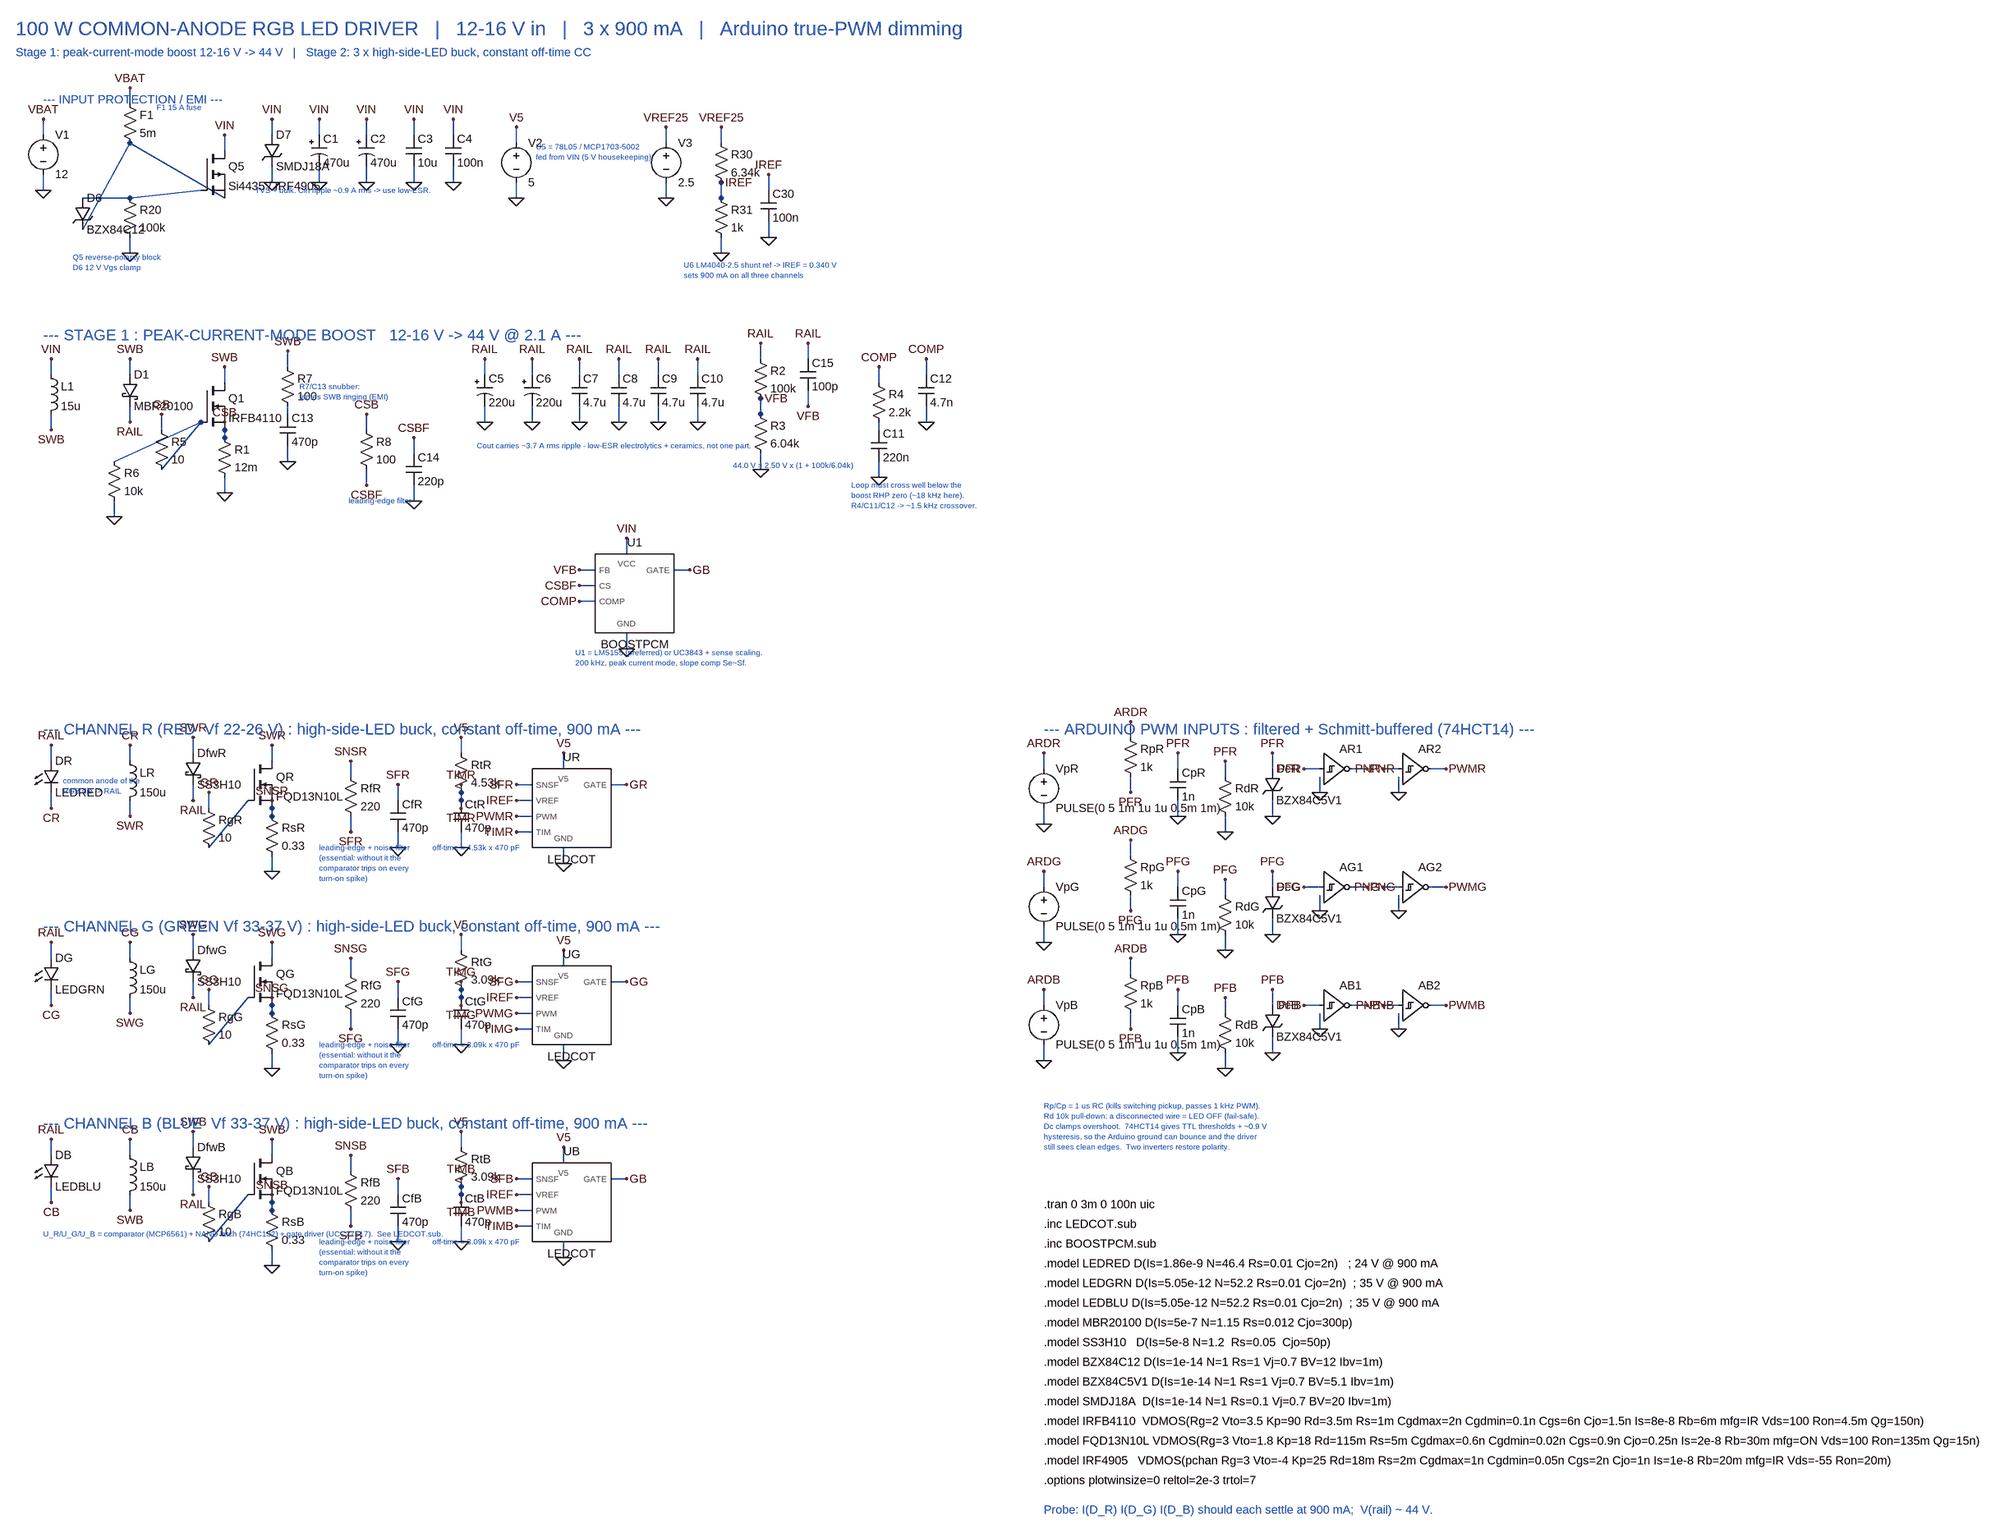
[diagram p0: schematic RGB100W_Driver.asc]
RGB100W_Driver.asc, the LTspice schematic file:
Version 4
SHEET 1 4800 3200
TEXT 40 40 Left 4 100 W COMMON-ANODE RGB LED DRIVER   |   12-16 V in   |   3 x 900 mA   |   Arduino true-PWM dimming
TEXT 40 88 Left 2 Stage 1: peak-current-mode boost 12-16 V -> 44 V   |   Stage 2: 3 x high-side-LED buck, constant off-time CC
TEXT 96 184 Left 2 --- INPUT PROTECTION / EMI ---
SYMBOL voltage 96 240 R0
SYMATTR InstName V1
SYMATTR Value 12
SYMATTR SpiceLine Rser=0.02
WIRE 96 336 96 368
FLAG 96 368 0
WIRE 96 256 96 224
FLAG 96 224 VBAT
SYMBOL res 256 176 R0
SYMATTR InstName F1
SYMATTR Value 5m
WIRE 272 192 272 160
FLAG 272 160 VBAT
TEXT 326 200 Left 1 F1 15 A fuse
SYMBOL pmos 416 288 R0
SYMATTR InstName Q5
SYMATTR Value Si4435 / IRF4905
WIRE 272 272 464 384
WIRE 464 288 464 256
FLAG 464 256 VIN
SYMBOL res 256 368 R0
SYMATTR InstName R20
SYMATTR Value 100k
WIRE 272 384 416 368
WIRE 272 464 272 496
FLAG 272 496 0
SYMBOL zener 160 384 R0
SYMATTR InstName D6
SYMATTR Value BZX84C12
WIRE 176 384 272 384
WIRE 176 448 272 272
TEXT 156 504 Left 1 Q5 reverse-polarity block\nD6 12 V Vgs clamp
SYMBOL zener 544 256 R0
SYMATTR InstName D7
SYMATTR Value SMDJ18A
WIRE 560 256 560 224
FLAG 560 224 VIN
WIRE 560 320 560 352
FLAG 560 352 0
SYMBOL polcap 640 256 R0
SYMATTR InstName C1
SYMATTR Value 470u
SYMATTR SpiceLine V=25 Rser=0.03
WIRE 656 256 656 224
FLAG 656 224 VIN
WIRE 656 320 656 352
FLAG 656 352 0
SYMBOL polcap 736 256 R0
SYMATTR InstName C2
SYMATTR Value 470u
SYMATTR SpiceLine V=25 Rser=0.03
WIRE 752 256 752 224
FLAG 752 224 VIN
WIRE 752 320 752 352
FLAG 752 352 0
SYMBOL cap 832 256 R0
SYMATTR InstName C3
SYMATTR Value 10u
SYMATTR SpiceLine V=25
WIRE 848 256 848 224
FLAG 848 224 VIN
WIRE 848 320 848 352
FLAG 848 352 0
SYMBOL cap 912 256 R0
SYMATTR InstName C4
SYMATTR Value 100n
WIRE 928 256 928 224
FLAG 928 224 VIN
WIRE 928 320 928 352
FLAG 928 352 0
TEXT 526 368 Left 1 TVS + bulk. Cin ripple ~0.9 A rms -> use low-ESR.
SYMBOL voltage 1056 256 R0
SYMATTR InstName V2
SYMATTR Value 5
WIRE 1056 272 1056 240
FLAG 1056 240 V5
WIRE 1056 352 1056 384
FLAG 1056 384 0
TEXT 1096 280 Left 1 U5 = 78L05 / MCP1703-5002\nfed from VIN (5 V housekeeping)
SYMBOL voltage 1360 256 R0
SYMATTR InstName V3
SYMATTR Value 2.5
WIRE 1360 272 1360 240
FLAG 1360 240 VREF25
WIRE 1360 352 1360 384
FLAG 1360 384 0
SYMBOL res 1456 256 R0
SYMATTR InstName R30
SYMATTR Value 6.34k
WIRE 1472 272 1472 240
FLAG 1472 240 VREF25
SYMBOL res 1456 368 R0
SYMATTR InstName R31
SYMATTR Value 1k
WIRE 1472 352 1472 384
WIRE 1472 464 1472 496
FLAG 1472 496 0
WIRE 1472 384 1472 352
FLAG 1472 352 IREF
SYMBOL cap 1552 368 R0
SYMATTR InstName C30
SYMATTR Value 100n
WIRE 1568 368 1568 336
FLAG 1568 336 IREF
WIRE 1568 432 1568 464
FLAG 1568 464 0
TEXT 1396 520 Left 1 U6 LM4040-2.5 shunt ref -> IREF = 0.340 V\nsets 900 mA on all three channels
TEXT 96 736 Left 3 --- STAGE 1 : PEAK-CURRENT-MODE BOOST   12-16 V -> 44 V @ 2.1 A ---
SYMBOL ind 96 800 R0
SYMATTR InstName L1
SYMATTR Value 15u
SYMATTR SpiceLine Rser=0.008 Ipk=14
WIRE 112 816 112 784
FLAG 112 784 VIN
WIRE 112 896 112 928
FLAG 112 928 SWB
SYMBOL schottky 256 816 R0
SYMATTR InstName D1
SYMATTR Value MBR20100
WIRE 272 816 272 784
FLAG 272 784 SWB
WIRE 272 880 272 912
FLAG 272 912 RAIL
SYMBOL nmos 416 832 R0
SYMATTR InstName Q1
SYMATTR Value IRFB4110
WIRE 464 832 464 800
FLAG 464 800 SWB
SYMBOL res 448 928 R0
SYMATTR InstName R1
SYMATTR Value 12m
WIRE 464 928 464 944
WIRE 464 1024 464 1056
FLAG 464 1056 0
WIRE 464 944 464 912
FLAG 464 912 CSB
SYMBOL res 320 912 R0
SYMATTR InstName R5
SYMATTR Value 10
WIRE 336 1008 416 912
WIRE 336 928 336 896
FLAG 336 896 GB
SYMBOL res 224 976 R0
SYMATTR InstName R6
SYMATTR Value 10k
WIRE 240 992 416 912
WIRE 240 1072 240 1104
FLAG 240 1104 0
SYMBOL res 576 784 R0
SYMATTR InstName R7
SYMATTR Value 100
WIRE 592 800 592 768
FLAG 592 768 SWB
SYMBOL cap 576 896 R0
SYMATTR InstName C13
SYMATTR Value 470p
WIRE 592 880 592 896
WIRE 592 960 592 992
FLAG 592 992 0
TEXT 616 840 Left 1 R7/C13 snubber:\ntames SWB ringing (EMI)
SYMBOL res 736 912 R0
SYMATTR InstName R8
SYMATTR Value 100
WIRE 752 928 752 896
FLAG 752 896 CSB
WIRE 752 1008 752 1040
FLAG 752 1040 CSBF
SYMBOL cap 832 976 R0
SYMATTR InstName C14
SYMATTR Value 220p
WIRE 848 976 848 944
FLAG 848 944 CSBF
WIRE 848 1040 848 1072
FLAG 848 1072 0
TEXT 716 1072 Left 1 leading-edge filter
SYMBOL polcap 976 816 R0
SYMATTR InstName C5
SYMATTR Value 220u
SYMATTR SpiceLine V=63 Rser=0.045
WIRE 992 816 992 784
FLAG 992 784 RAIL
WIRE 992 880 992 912
FLAG 992 912 0
SYMBOL polcap 1072 816 R0
SYMATTR InstName C6
SYMATTR Value 220u
SYMATTR SpiceLine V=63 Rser=0.045
WIRE 1088 816 1088 784
FLAG 1088 784 RAIL
WIRE 1088 880 1088 912
FLAG 1088 912 0
SYMBOL cap 1168 816 R0
SYMATTR InstName C7
SYMATTR Value 4.7u
SYMATTR SpiceLine V=100
WIRE 1184 816 1184 784
FLAG 1184 784 RAIL
WIRE 1184 880 1184 912
FLAG 1184 912 0
SYMBOL cap 1248 816 R0
SYMATTR InstName C8
SYMATTR Value 4.7u
SYMATTR SpiceLine V=100
WIRE 1264 816 1264 784
FLAG 1264 784 RAIL
WIRE 1264 880 1264 912
FLAG 1264 912 0
SYMBOL cap 1328 816 R0
SYMATTR InstName C9
SYMATTR Value 4.7u
SYMATTR SpiceLine V=100
WIRE 1344 816 1344 784
FLAG 1344 784 RAIL
WIRE 1344 880 1344 912
FLAG 1344 912 0
SYMBOL cap 1408 816 R0
SYMATTR InstName C10
SYMATTR Value 4.7u
SYMATTR SpiceLine V=100
WIRE 1424 816 1424 784
FLAG 1424 784 RAIL
WIRE 1424 880 1424 912
FLAG 1424 912 0
TEXT 976 960 Left 1 Cout carries ~3.7 A rms ripple - low-ESR electrolytics + ceramics, not one part.
SYMBOL res 1536 768 R0
SYMATTR InstName R2
SYMATTR Value 100k
WIRE 1552 784 1552 752
FLAG 1552 752 RAIL
SYMBOL res 1536 880 R0
SYMATTR InstName R3
SYMATTR Value 6.04k
WIRE 1552 864 1552 896
WIRE 1552 976 1552 1008
FLAG 1552 1008 0
WIRE 1552 896 1552 864
FLAG 1552 864 VFB
SYMBOL cap 1632 784 R0
SYMATTR InstName C15
SYMATTR Value 100p
WIRE 1648 784 1648 752
FLAG 1648 752 RAIL
WIRE 1648 848 1648 880
FLAG 1648 880 VFB
TEXT 1496 1000 Left 1 44.0 V = 2.50 V x (1 + 100k/6.04k)
SYMBOL res 1776 816 R0
SYMATTR InstName R4
SYMATTR Value 2.2k
WIRE 1792 832 1792 800
FLAG 1792 800 COMP
SYMBOL cap 1776 928 R0
SYMATTR InstName C11
SYMATTR Value 220n
WIRE 1792 912 1792 928
WIRE 1792 992 1792 1024
FLAG 1792 1024 0
SYMBOL cap 1872 816 R0
SYMATTR InstName C12
SYMATTR Value 4.7n
WIRE 1888 816 1888 784
FLAG 1888 784 COMP
WIRE 1888 880 1888 912
FLAG 1888 912 0
TEXT 1736 1040 Left 1 Loop must cross well below the\nboost RHP zero (~18 kHz here).\nR4/C11/C12 -> ~1.5 kHz crossover.
SYMBOL BOOSTPCM 1216 1180 R0
SYMATTR InstName U1
SYMATTR Value BOOSTPCM
SYMATTR SpiceLine Fsw=200k Ksl=0.13 Vthmax=0.42
WIRE 1216 1212 1184 1212
FLAG 1184 1212 VFB
WIRE 1216 1244 1184 1244
FLAG 1184 1244 CSBF
WIRE 1216 1276 1184 1276
FLAG 1184 1276 COMP
WIRE 1376 1212 1408 1212
FLAG 1408 1212 GB
WIRE 1280 1180 1280 1148
FLAG 1280 1148 VIN
WIRE 1280 1340 1280 1372
FLAG 1280 1372 0
TEXT 1176 1380 Left 1 U1 = LM5155 (preferred) or UC3843 + sense scaling.\n200 kHz, peak current mode, slope comp Se~Sf.
TEXT 96 1536 Left 3 --- CHANNEL R (RED  Vf 22-26 V) : high-side-LED buck, constant off-time, 900 mA ---
SYMBOL LED 96 1600 R0
SYMATTR InstName DR
SYMATTR Value LEDRED
WIRE 112 1600 112 1568
FLAG 112 1568 RAIL
WIRE 112 1664 112 1696
FLAG 112 1696 CR
TEXT 136 1640 Left 1 common anode of the\nRGB die -> RAIL
SYMBOL ind 256 1584 R0
SYMATTR InstName LR
SYMATTR Value 150u
SYMATTR SpiceLine Rser=0.15 Ipk=2
WIRE 272 1600 272 1568
FLAG 272 1568 CR
WIRE 272 1680 272 1712
FLAG 272 1712 SWR
SYMBOL schottky 384 1584 R0
SYMATTR InstName DfwR
SYMATTR Value SS3H10
WIRE 400 1584 400 1552
FLAG 400 1552 SWR
WIRE 400 1648 400 1680
FLAG 400 1680 RAIL
SYMBOL nmos 512 1600 R0
SYMATTR InstName QR
SYMATTR Value FQD13N10L
WIRE 560 1600 560 1568
FLAG 560 1568 SWR
SYMBOL res 544 1696 R0
SYMATTR InstName RsR
SYMATTR Value 0.33
WIRE 560 1696 560 1712
WIRE 560 1792 560 1824
FLAG 560 1824 0
WIRE 560 1712 560 1680
FLAG 560 1680 SNSR
SYMBOL res 416 1680 R0
SYMATTR InstName RgR
SYMATTR Value 10
WIRE 432 1776 512 1680
WIRE 432 1696 432 1664
FLAG 432 1664 GR
SYMBOL res 704 1616 R0
SYMATTR InstName RfR
SYMATTR Value 220
WIRE 720 1632 720 1600
FLAG 720 1600 SNSR
WIRE 720 1712 720 1744
FLAG 720 1744 SFR
SYMBOL cap 800 1680 R0
SYMATTR InstName CfR
SYMATTR Value 470p
WIRE 816 1680 816 1648
FLAG 816 1648 SFR
WIRE 816 1744 816 1776
FLAG 816 1776 0
TEXT 656 1776 Left 1 leading-edge + noise filter\n(essential: without it the\ncomparator trips on every\nturn-on spike)
SYMBOL res 928 1568 R0
SYMATTR InstName RtR
SYMATTR Value 4.53k
WIRE 944 1584 944 1552
FLAG 944 1552 V5
WIRE 944 1664 944 1696
FLAG 944 1696 TIMR
SYMBOL cap 928 1680 R0
SYMATTR InstName CtR
SYMATTR Value 470p
WIRE 944 1680 944 1648
FLAG 944 1648 TIMR
WIRE 944 1744 944 1776
FLAG 944 1776 0
TEXT 886 1776 Left 1 off-time = 4.53k x 470 pF
SYMBOL LEDCOT 1088 1616 R0
SYMATTR InstName UR
SYMATTR Value LEDCOT
WIRE 1088 1648 1056 1648
FLAG 1056 1648 SFR
WIRE 1088 1680 1056 1680
FLAG 1056 1680 IREF
WIRE 1088 1712 1056 1712
FLAG 1056 1712 PWMR
WIRE 1088 1744 1056 1744
FLAG 1056 1744 TIMR
WIRE 1248 1648 1280 1648
FLAG 1280 1648 GR
WIRE 1152 1616 1152 1584
FLAG 1152 1584 V5
WIRE 1152 1776 1152 1808
FLAG 1152 1808 0
TEXT 96 1936 Left 3 --- CHANNEL G (GREEN Vf 33-37 V) : high-side-LED buck, constant off-time, 900 mA ---
SYMBOL LED 96 2000 R0
SYMATTR InstName DG
SYMATTR Value LEDGRN
WIRE 112 2000 112 1968
FLAG 112 1968 RAIL
WIRE 112 2064 112 2096
FLAG 112 2096 CG
TEXT 136 2040 Left 1 
SYMBOL ind 256 1984 R0
SYMATTR InstName LG
SYMATTR Value 150u
SYMATTR SpiceLine Rser=0.15 Ipk=2
WIRE 272 2000 272 1968
FLAG 272 1968 CG
WIRE 272 2080 272 2112
FLAG 272 2112 SWG
SYMBOL schottky 384 1984 R0
SYMATTR InstName DfwG
SYMATTR Value SS3H10
WIRE 400 1984 400 1952
FLAG 400 1952 SWG
WIRE 400 2048 400 2080
FLAG 400 2080 RAIL
SYMBOL nmos 512 2000 R0
SYMATTR InstName QG
SYMATTR Value FQD13N10L
WIRE 560 2000 560 1968
FLAG 560 1968 SWG
SYMBOL res 544 2096 R0
SYMATTR InstName RsG
SYMATTR Value 0.33
WIRE 560 2096 560 2112
WIRE 560 2192 560 2224
FLAG 560 2224 0
WIRE 560 2112 560 2080
FLAG 560 2080 SNSG
SYMBOL res 416 2080 R0
SYMATTR InstName RgG
SYMATTR Value 10
WIRE 432 2176 512 2080
WIRE 432 2096 432 2064
FLAG 432 2064 GG
SYMBOL res 704 2016 R0
SYMATTR InstName RfG
SYMATTR Value 220
WIRE 720 2032 720 2000
FLAG 720 2000 SNSG
WIRE 720 2112 720 2144
FLAG 720 2144 SFG
SYMBOL cap 800 2080 R0
SYMATTR InstName CfG
SYMATTR Value 470p
WIRE 816 2080 816 2048
FLAG 816 2048 SFG
WIRE 816 2144 816 2176
FLAG 816 2176 0
TEXT 656 2176 Left 1 leading-edge + noise filter\n(essential: without it the\ncomparator trips on every\nturn-on spike)
SYMBOL res 928 1968 R0
SYMATTR InstName RtG
SYMATTR Value 3.09k
WIRE 944 1984 944 1952
FLAG 944 1952 V5
WIRE 944 2064 944 2096
FLAG 944 2096 TIMG
SYMBOL cap 928 2080 R0
SYMATTR InstName CtG
SYMATTR Value 470p
WIRE 944 2080 944 2048
FLAG 944 2048 TIMG
WIRE 944 2144 944 2176
FLAG 944 2176 0
TEXT 886 2176 Left 1 off-time = 3.09k x 470 pF
SYMBOL LEDCOT 1088 2016 R0
SYMATTR InstName UG
SYMATTR Value LEDCOT
WIRE 1088 2048 1056 2048
FLAG 1056 2048 SFG
WIRE 1088 2080 1056 2080
FLAG 1056 2080 IREF
WIRE 1088 2112 1056 2112
FLAG 1056 2112 PWMG
WIRE 1088 2144 1056 2144
FLAG 1056 2144 TIMG
WIRE 1248 2048 1280 2048
FLAG 1280 2048 GG
WIRE 1152 2016 1152 1984
FLAG 1152 1984 V5
WIRE 1152 2176 1152 2208
FLAG 1152 2208 0
TEXT 96 2336 Left 3 --- CHANNEL B (BLUE  Vf 33-37 V) : high-side-LED buck, constant off-time, 900 mA ---
SYMBOL LED 96 2400 R0
SYMATTR InstName DB
SYMATTR Value LEDBLU
WIRE 112 2400 112 2368
FLAG 112 2368 RAIL
WIRE 112 2464 112 2496
FLAG 112 2496 CB
TEXT 136 2440 Left 1 
SYMBOL ind 256 2384 R0
SYMATTR InstName LB
SYMATTR Value 150u
SYMATTR SpiceLine Rser=0.15 Ipk=2
WIRE 272 2400 272 2368
FLAG 272 2368 CB
WIRE 272 2480 272 2512
FLAG 272 2512 SWB
SYMBOL schottky 384 2384 R0
SYMATTR InstName DfwB
SYMATTR Value SS3H10
WIRE 400 2384 400 2352
FLAG 400 2352 SWB
WIRE 400 2448 400 2480
FLAG 400 2480 RAIL
SYMBOL nmos 512 2400 R0
SYMATTR InstName QB
SYMATTR Value FQD13N10L
WIRE 560 2400 560 2368
FLAG 560 2368 SWB
SYMBOL res 544 2496 R0
SYMATTR InstName RsB
SYMATTR Value 0.33
WIRE 560 2496 560 2512
WIRE 560 2592 560 2624
FLAG 560 2624 0
WIRE 560 2512 560 2480
FLAG 560 2480 SNSB
SYMBOL res 416 2480 R0
SYMATTR InstName RgB
SYMATTR Value 10
WIRE 432 2576 512 2480
WIRE 432 2496 432 2464
FLAG 432 2464 GB
SYMBOL res 704 2416 R0
SYMATTR InstName RfB
SYMATTR Value 220
WIRE 720 2432 720 2400
FLAG 720 2400 SNSB
WIRE 720 2512 720 2544
FLAG 720 2544 SFB
SYMBOL cap 800 2480 R0
SYMATTR InstName CfB
SYMATTR Value 470p
WIRE 816 2480 816 2448
FLAG 816 2448 SFB
WIRE 816 2544 816 2576
FLAG 816 2576 0
TEXT 656 2576 Left 1 leading-edge + noise filter\n(essential: without it the\ncomparator trips on every\nturn-on spike)
SYMBOL res 928 2368 R0
SYMATTR InstName RtB
SYMATTR Value 3.09k
WIRE 944 2384 944 2352
FLAG 944 2352 V5
WIRE 944 2464 944 2496
FLAG 944 2496 TIMB
SYMBOL cap 928 2480 R0
SYMATTR InstName CtB
SYMATTR Value 470p
WIRE 944 2480 944 2448
FLAG 944 2448 TIMB
WIRE 944 2544 944 2576
FLAG 944 2576 0
TEXT 886 2576 Left 1 off-time = 3.09k x 470 pF
SYMBOL LEDCOT 1088 2416 R0
SYMATTR InstName UB
SYMATTR Value LEDCOT
WIRE 1088 2448 1056 2448
FLAG 1056 2448 SFB
WIRE 1088 2480 1056 2480
FLAG 1056 2480 IREF
WIRE 1088 2512 1056 2512
FLAG 1056 2512 PWMB
WIRE 1088 2544 1056 2544
FLAG 1056 2544 TIMB
WIRE 1248 2448 1280 2448
FLAG 1280 2448 GB
WIRE 1152 2416 1152 2384
FLAG 1152 2384 V5
WIRE 1152 2576 1152 2608
FLAG 1152 2608 0
TEXT 96 2560 Left 1 U_R/U_G/U_B = comparator (MCP6561) + NAND latch (74HC132) + gate driver (UCC27517).  See LEDCOT.sub.
TEXT 2400 1536 Left 3 --- ARDUINO PWM INPUTS : filtered + Schmitt-buffered (74HCT14) ---
SYMBOL voltage 2400 1600 R0
SYMATTR InstName VpR
SYMATTR Value PULSE(0 5 1m 1u 1u 0.5m 1m)
WIRE 2400 1696 2400 1728
FLAG 2400 1728 0
WIRE 2400 1616 2400 1584
FLAG 2400 1584 ARDR
SYMBOL res 2560 1536 R0
SYMATTR InstName RpR
SYMATTR Value 1k
WIRE 2576 1552 2576 1520
FLAG 2576 1520 ARDR
WIRE 2576 1632 2576 1664
FLAG 2576 1664 PFR
SYMBOL cap 2656 1616 R0
SYMATTR InstName CpR
SYMATTR Value 1n
WIRE 2672 1616 2672 1584
FLAG 2672 1584 PFR
WIRE 2672 1680 2672 1712
FLAG 2672 1712 0
SYMBOL res 2752 1616 R0
SYMATTR InstName RdR
SYMATTR Value 10k
WIRE 2768 1632 2768 1600
FLAG 2768 1600 PFR
WIRE 2768 1712 2768 1744
FLAG 2768 1744 0
SYMBOL zener 2848 1616 R0
SYMATTR InstName DcR
SYMATTR Value BZX84C5V1
WIRE 2864 1616 2864 1584
FLAG 2864 1584 PFR
WIRE 2864 1680 2864 1712
FLAG 2864 1712 0
SYMBOL Digital\schmtinv 2960 1552 R0
SYMATTR InstName AR1
SYMATTR SpiceLine Vt=1.6 Vh=0.4 Vhigh=5 Trise=15n Tfall=15n
WIRE 2960 1616 2928 1616
FLAG 2928 1616 PFR
WIRE 3024 1616 3056 1616
FLAG 3056 1616 PNR
WIRE 2960 1632 2960 1664
FLAG 2960 1664 0
SYMBOL Digital\schmtinv 3120 1552 R0
SYMATTR InstName AR2
SYMATTR SpiceLine Vt=1.6 Vh=0.4 Vhigh=5 Trise=15n Tfall=15n
WIRE 3120 1616 3088 1616
FLAG 3088 1616 PNR
WIRE 3184 1616 3216 1616
FLAG 3216 1616 PWMR
WIRE 3120 1632 3120 1664
FLAG 3120 1664 0
SYMBOL voltage 2400 1840 R0
SYMATTR InstName VpG
SYMATTR Value PULSE(0 5 1m 1u 1u 0.5m 1m)
WIRE 2400 1936 2400 1968
FLAG 2400 1968 0
WIRE 2400 1856 2400 1824
FLAG 2400 1824 ARDG
SYMBOL res 2560 1776 R0
SYMATTR InstName RpG
SYMATTR Value 1k
WIRE 2576 1792 2576 1760
FLAG 2576 1760 ARDG
WIRE 2576 1872 2576 1904
FLAG 2576 1904 PFG
SYMBOL cap 2656 1856 R0
SYMATTR InstName CpG
SYMATTR Value 1n
WIRE 2672 1856 2672 1824
FLAG 2672 1824 PFG
WIRE 2672 1920 2672 1952
FLAG 2672 1952 0
SYMBOL res 2752 1856 R0
SYMATTR InstName RdG
SYMATTR Value 10k
WIRE 2768 1872 2768 1840
FLAG 2768 1840 PFG
WIRE 2768 1952 2768 1984
FLAG 2768 1984 0
SYMBOL zener 2848 1856 R0
SYMATTR InstName DcG
SYMATTR Value BZX84C5V1
WIRE 2864 1856 2864 1824
FLAG 2864 1824 PFG
WIRE 2864 1920 2864 1952
FLAG 2864 1952 0
SYMBOL Digital\schmtinv 2960 1792 R0
SYMATTR InstName AG1
SYMATTR SpiceLine Vt=1.6 Vh=0.4 Vhigh=5 Trise=15n Tfall=15n
WIRE 2960 1856 2928 1856
FLAG 2928 1856 PFG
WIRE 3024 1856 3056 1856
FLAG 3056 1856 PNG
WIRE 2960 1872 2960 1904
FLAG 2960 1904 0
SYMBOL Digital\schmtinv 3120 1792 R0
SYMATTR InstName AG2
SYMATTR SpiceLine Vt=1.6 Vh=0.4 Vhigh=5 Trise=15n Tfall=15n
WIRE 3120 1856 3088 1856
FLAG 3088 1856 PNG
WIRE 3184 1856 3216 1856
FLAG 3216 1856 PWMG
WIRE 3120 1872 3120 1904
FLAG 3120 1904 0
SYMBOL voltage 2400 2080 R0
SYMATTR InstName VpB
SYMATTR Value PULSE(0 5 1m 1u 1u 0.5m 1m)
WIRE 2400 2176 2400 2208
FLAG 2400 2208 0
WIRE 2400 2096 2400 2064
FLAG 2400 2064 ARDB
SYMBOL res 2560 2016 R0
SYMATTR InstName RpB
SYMATTR Value 1k
WIRE 2576 2032 2576 2000
FLAG 2576 2000 ARDB
WIRE 2576 2112 2576 2144
FLAG 2576 2144 PFB
SYMBOL cap 2656 2096 R0
SYMATTR InstName CpB
SYMATTR Value 1n
WIRE 2672 2096 2672 2064
FLAG 2672 2064 PFB
WIRE 2672 2160 2672 2192
FLAG 2672 2192 0
SYMBOL res 2752 2096 R0
SYMATTR InstName RdB
SYMATTR Value 10k
WIRE 2768 2112 2768 2080
FLAG 2768 2080 PFB
WIRE 2768 2192 2768 2224
FLAG 2768 2224 0
SYMBOL zener 2848 2096 R0
SYMATTR InstName DcB
SYMATTR Value BZX84C5V1
WIRE 2864 2096 2864 2064
FLAG 2864 2064 PFB
WIRE 2864 2160 2864 2192
FLAG 2864 2192 0
SYMBOL Digital\schmtinv 2960 2032 R0
SYMATTR InstName AB1
SYMATTR SpiceLine Vt=1.6 Vh=0.4 Vhigh=5 Trise=15n Tfall=15n
WIRE 2960 2096 2928 2096
FLAG 2928 2096 PFB
WIRE 3024 2096 3056 2096
FLAG 3056 2096 PNB
WIRE 2960 2112 2960 2144
FLAG 2960 2144 0
SYMBOL Digital\schmtinv 3120 2032 R0
SYMATTR InstName AB2
SYMATTR SpiceLine Vt=1.6 Vh=0.4 Vhigh=5 Trise=15n Tfall=15n
WIRE 3120 2096 3088 2096
FLAG 3088 2096 PNB
WIRE 3184 2096 3216 2096
FLAG 3216 2096 PWMB
WIRE 3120 2112 3120 2144
FLAG 3120 2144 0
TEXT 2400 2300 Left 1 Rp/Cp = 1 us RC (kills switching pickup, passes 1 kHz PWM).\nRd 10k pull-down: a disconnected wire = LED OFF (fail-safe).\nDc clamps overshoot.  74HCT14 gives TTL thresholds + ~0.9 V\nhysteresis, so the Arduino ground can bounce and the driver\nstill sees clean edges.  Two inverters restore polarity.
TEXT 2400 2500 Left 2 !.tran 0 3m 0 100n uic
TEXT 2400 2540 Left 2 !.inc LEDCOT.sub
TEXT 2400 2580 Left 2 !.inc BOOSTPCM.sub
TEXT 2400 2620 Left 2 !.model LEDRED D(Is=1.86e-9 N=46.4 Rs=0.01 Cjo=2n)   ; 24 V @ 900 mA
TEXT 2400 2660 Left 2 !.model LEDGRN D(Is=5.05e-12 N=52.2 Rs=0.01 Cjo=2n)  ; 35 V @ 900 mA
TEXT 2400 2700 Left 2 !.model LEDBLU D(Is=5.05e-12 N=52.2 Rs=0.01 Cjo=2n)  ; 35 V @ 900 mA
TEXT 2400 2740 Left 2 !.model MBR20100 D(Is=5e-7 N=1.15 Rs=0.012 Cjo=300p)
TEXT 2400 2780 Left 2 !.model SS3H10   D(Is=5e-8 N=1.2  Rs=0.05  Cjo=50p)
TEXT 2400 2820 Left 2 !.model BZX84C12 D(Is=1e-14 N=1 Rs=1 Vj=0.7 BV=12 Ibv=1m)
TEXT 2400 2860 Left 2 !.model BZX84C5V1 D(Is=1e-14 N=1 Rs=1 Vj=0.7 BV=5.1 Ibv=1m)
TEXT 2400 2900 Left 2 !.model SMDJ18A  D(Is=1e-14 N=1 Rs=0.1 Vj=0.7 BV=20 Ibv=1m)
TEXT 2400 2940 Left 2 !.model IRFB4110  VDMOS(Rg=2 Vto=3.5 Kp=90 Rd=3.5m Rs=1m Cgdmax=2n Cgdmin=0.1n Cgs=6n Cjo=1.5n Is=8e-8 Rb=6m mfg=IR Vds=100 Ron=4.5m Qg=150n)
TEXT 2400 2980 Left 2 !.model FQD13N10L VDMOS(Rg=3 Vto=1.8 Kp=18 Rd=115m Rs=5m Cgdmax=0.6n Cgdmin=0.02n Cgs=0.9n Cjo=0.25n Is=2e-8 Rb=30m mfg=ON Vds=100 Ron=135m Qg=15n)
TEXT 2400 3020 Left 2 !.model IRF4905   VDMOS(pchan Rg=3 Vto=-4 Kp=25 Rd=18m Rs=2m Cgdmax=1n Cgdmin=0.05n Cgs=2n Cjo=1n Is=1e-8 Rb=20m mfg=IR Vds=-55 Ron=20m)
TEXT 2400 3060 Left 2 !.options plotwinsize=0 reltol=2e-3 trtol=7
TEXT 2400 3120 Left 2 Probe: I(D_R) I(D_G) I(D_B) should each settle at 900 mA;  V(rail) ~ 44 V.

The netlist it stands for:
* RGB100W_Driver.asc
V1 VBAT 0 12 Rser=0.02
R§F1 VBAT N001 5m
M§Q5 VIN N002 N001 N001 Si4435 / IRF4905
R20 N002 0 100k
D6 N002 N001 BZX84C12
D7 VIN 0 SMDJ18A
C1 VIN 0 470u V=25 Rser=0.03
C2 VIN 0 470u V=25 Rser=0.03
C3 VIN 0 10u V=25
C4 VIN 0 100n
V2 V5 0 5
V3 VREF25 0 2.5
R30 VREF25 IREF 6.34k
R31 IREF 0 1k
C30 IREF 0 100n
L1 VIN SWB 15u Rser=0.008 Ipk=14
D1 SWB RAIL MBR20100
M§Q1 SWB N003 CSB CSB IRFB4110
R1 CSB 0 12m
R5 GB N003 10
R6 N003 0 10k
R7 SWB N004 100
C13 N004 0 470p
R8 CSB CSBF 100
C14 CSBF 0 220p
C5 RAIL 0 220u V=63 Rser=0.045
C6 RAIL 0 220u V=63 Rser=0.045
C7 RAIL 0 4.7u V=100
C8 RAIL 0 4.7u V=100
C9 RAIL 0 4.7u V=100
C10 RAIL 0 4.7u V=100
R2 RAIL VFB 100k
R3 VFB 0 6.04k
C15 RAIL VFB 100p
R4 COMP N005 2.2k
C11 N005 0 220n
C12 COMP 0 4.7n
XU1 VFB CSBF COMP GB VIN 0 BOOSTPCM Fsw=200k Ksl=0.13 Vthmax=0.42  ; pins FB CS COMP GATE VCC GND
DR RAIL CR LEDRED
LR CR SWR 150u Rser=0.15 Ipk=2
DfwR SWR RAIL SS3H10
M§QR SWR N006 SNSR SNSR FQD13N10L
RsR SNSR 0 0.33
RgR GR N006 10
RfR SNSR SFR 220
CfR SFR 0 470p
RtR V5 TIMR 4.53k
CtR TIMR 0 470p
XUR SFR IREF PWMR TIMR GR V5 0 LEDCOT  ; pins SNSF VREF PWM TIM GATE V5 GND
DG RAIL CG LEDGRN
LG CG SWG 150u Rser=0.15 Ipk=2
DfwG SWG RAIL SS3H10
M§QG SWG N007 SNSG SNSG FQD13N10L
RsG SNSG 0 0.33
RgG GG N007 10
RfG SNSG SFG 220
CfG SFG 0 470p
RtG V5 TIMG 3.09k
CtG TIMG 0 470p
XUG SFG IREF PWMG TIMG GG V5 0 LEDCOT  ; pins SNSF VREF PWM TIM GATE V5 GND
DB RAIL CB LEDBLU
LB CB SWB 150u Rser=0.15 Ipk=2
DfwB SWB RAIL SS3H10
M§QB SWB N008 SNSB SNSB FQD13N10L
RsB SNSB 0 0.33
RgB GB N008 10
RfB SNSB SFB 220
CfB SFB 0 470p
RtB V5 TIMB 3.09k
CtB TIMB 0 470p
XUB SFB IREF PWMB TIMB GB V5 0 LEDCOT  ; pins SNSF VREF PWM TIM GATE V5 GND
VpR ARDR 0 PULSE(0 5 1m 1u 1u 0.5m 1m)
RpR ARDR PFR 1k
CpR PFR 0 1n
RdR PFR 0 10k
DcR PFR 0 BZX84C5V1
AR1 PFR 0 0 0 0 PNR 0 0 SCHMITT Vt=1.6 Vh=0.4 Vhigh=5 Trise=15n Tfall=15n
AR2 PNR 0 0 0 0 PWMR 0 0 SCHMITT Vt=1.6 Vh=0.4 Vhigh=5 Trise=15n Tfall=15n
VpG ARDG 0 PULSE(0 5 1m 1u 1u 0.5m 1m)
RpG ARDG PFG 1k
CpG PFG 0 1n
RdG PFG 0 10k
DcG PFG 0 BZX84C5V1
AG1 PFG 0 0 0 0 PNG 0 0 SCHMITT Vt=1.6 Vh=0.4 Vhigh=5 Trise=15n Tfall=15n
AG2 PNG 0 0 0 0 PWMG 0 0 SCHMITT Vt=1.6 Vh=0.4 Vhigh=5 Trise=15n Tfall=15n
VpB ARDB 0 PULSE(0 5 1m 1u 1u 0.5m 1m)
RpB ARDB PFB 1k
CpB PFB 0 1n
RdB PFB 0 10k
DcB PFB 0 BZX84C5V1
AB1 PFB 0 0 0 0 PNB 0 0 SCHMITT Vt=1.6 Vh=0.4 Vhigh=5 Trise=15n Tfall=15n
AB2 PNB 0 0 0 0 PWMB 0 0 SCHMITT Vt=1.6 Vh=0.4 Vhigh=5 Trise=15n Tfall=15n
.model D D
.lib standard.dio
.model NMOS NMOS
.model PMOS PMOS
.lib standard.mos
* 100 W COMMON-ANODE RGB LED DRIVER   |   12-16 V in   |   3 x 900 mA   |   Arduino true-PWM dimming
* Stage 1: peak-current-mode boost 12-16 V -> 44 V   |   Stage 2: 3 x high-side-LED buck, constant off-time CC
* --- INPUT PROTECTION / EMI ---
* F1 15 A fuse
* Q5 reverse-polarity block
* D6 12 V Vgs clamp
* TVS + bulk. Cin ripple ~0.9 A rms -> use low-ESR.
* U5 = 78L05 / MCP1703-5002
* fed from VIN (5 V housekeeping)
* U6 LM4040-2.5 shunt ref -> IREF = 0.340 V
* sets 900 mA on all three channels
* --- STAGE 1 : PEAK-CURRENT-MODE BOOST   12-16 V -> 44 V @ 2.1 A ---
* R7/C13 snubber:
* tames SWB ringing (EMI)
* leading-edge filter
* Cout carries ~3.7 A rms ripple - low-ESR electrolytics + ceramics, not one part.
* 44.0 V = 2.50 V x (1 + 100k/6.04k)
* Loop must cross well below the
* boost RHP zero (~18 kHz here).
* R4/C11/C12 -> ~1.5 kHz crossover.
* U1 = LM5155 (preferred) or UC3843 + sense scaling.
* 200 kHz, peak current mode, slope comp Se~Sf.
* --- CHANNEL R (RED  Vf 22-26 V) : high-side-LED buck, constant off-time, 900 mA ---
* common anode of the
* RGB die -> RAIL
* leading-edge + noise filter
* (essential: without it the
* comparator trips on every
* turn-on spike)
* off-time = 4.53k x 470 pF
* --- CHANNEL G (GREEN Vf 33-37 V) : high-side-LED buck, constant off-time, 900 mA ---
* leading-edge + noise filter
* (essential: without it the
* comparator trips on every
* turn-on spike)
* off-time = 3.09k x 470 pF
* --- CHANNEL B (BLUE  Vf 33-37 V) : high-side-LED buck, constant off-time, 900 mA ---
* leading-edge + noise filter
* (essential: without it the
* comparator trips on every
* turn-on spike)
* off-time = 3.09k x 470 pF
* U_R/U_G/U_B = comparator (MCP6561) + NAND latch (74HC132) + gate driver (UCC27517).  See LEDCOT.sub.
* --- ARDUINO PWM INPUTS : filtered + Schmitt-buffered (74HCT14) ---
* Rp/Cp = 1 us RC (kills switching pickup, passes 1 kHz PWM).
* Rd 10k pull-down: a disconnected wire = LED OFF (fail-safe).
* Dc clamps overshoot.  74HCT14 gives TTL thresholds + ~0.9 V
* hysteresis, so the Arduino ground can bounce and the driver
* still sees clean edges.  Two inverters restore polarity.
.tran 0 3m 0 100n uic
.inc LEDCOT.sub
.inc BOOSTPCM.sub
.model LEDRED D(Is=1.86e-9 N=46.4 Rs=0.01 Cjo=2n)   ; 24 V @ 900 mA
.model LEDGRN D(Is=5.05e-12 N=52.2 Rs=0.01 Cjo=2n)  ; 35 V @ 900 mA
.model LEDBLU D(Is=5.05e-12 N=52.2 Rs=0.01 Cjo=2n)  ; 35 V @ 900 mA
.model MBR20100 D(Is=5e-7 N=1.15 Rs=0.012 Cjo=300p)
.model SS3H10   D(Is=5e-8 N=1.2  Rs=0.05  Cjo=50p)
.model BZX84C12 D(Is=1e-14 N=1 Rs=1 Vj=0.7 BV=12 Ibv=1m)
.model BZX84C5V1 D(Is=1e-14 N=1 Rs=1 Vj=0.7 BV=5.1 Ibv=1m)
.model SMDJ18A  D(Is=1e-14 N=1 Rs=0.1 Vj=0.7 BV=20 Ibv=1m)
.model IRFB4110  VDMOS(Rg=2 Vto=3.5 Kp=90 Rd=3.5m Rs=1m Cgdmax=2n Cgdmin=0.1n Cgs=6n Cjo=1.5n Is=8e-8 Rb=6m mfg=IR Vds=100 Ron=4.5m Qg=150n)
.model FQD13N10L VDMOS(Rg=3 Vto=1.8 Kp=18 Rd=115m Rs=5m Cgdmax=0.6n Cgdmin=0.02n Cgs=0.9n Cjo=0.25n Is=2e-8 Rb=30m mfg=ON Vds=100 Ron=135m Qg=15n)
.model IRF4905   VDMOS(pchan Rg=3 Vto=-4 Kp=25 Rd=18m Rs=2m Cgdmax=1n Cgdmin=0.05n Cgs=2n Cjo=1n Is=1e-8 Rb=20m mfg=IR Vds=-55 Ron=20m)
.options plotwinsize=0 reltol=2e-3 trtol=7
* Probe: I(D_R) I(D_G) I(D_B) should each settle at 900 mA;  V(rail) ~ 44 V.
.backanno
.end